# Altium schematic sheet NB3000_Complex.SchDoc
size A4
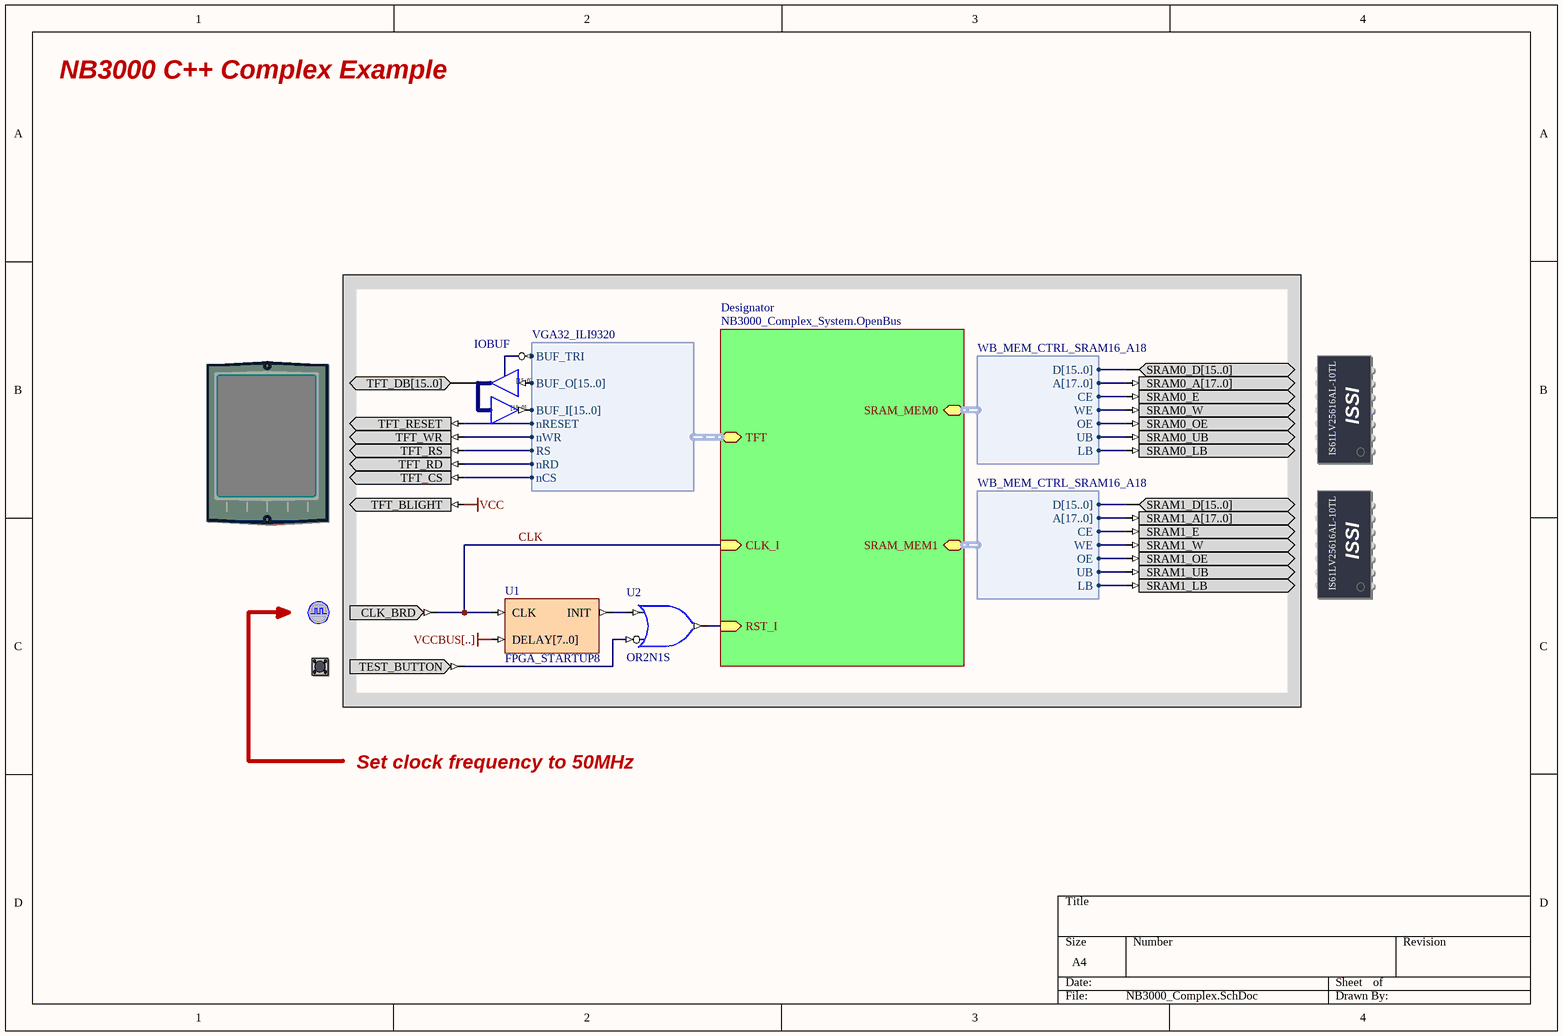
[diagram p0: NB3000_Complex.SchDoc]

## Parts
(Parts that share a designator on the sheet are numbered #1, #2 ... from top to bottom, then left to right.)
?#1  SRAM0  (value not drawn)
?#2  TFT_LCD  (value not drawn)
?#3  SRAM1  (value not drawn)
?#4  CLOCK_BOARD  (value not drawn)
?#5  TEST_BUTTON  (value not drawn)
IOBUF  IOBUF16B  (value not drawn)
U1  FPGA_STARTUP8
U2  OR2N1S

## Sub-sheets
Designator = NB3000_Complex_System.OpenBus: RST_I (in), CLK_I (in), SRAM_MEM0 (harness WB_MEM_CTRL_SRAM16_A18), SRAM_MEM1 (harness WB_MEM_CTRL_SRAM16_A18), TFT (harness VGA32_ILI9320)

## Harnesses
VGA32_ILI9320: BUF_TRI, BUF_O[15..0], BUF_I[15..0], nRESET, nWR, RS, nRD, nCS
WB_MEM_CTRL_SRAM16_A18: D[15..0], A[17..0], CE, WE, OE, UB, LB

## Nets
VCC: ?#2.TFT_BLIGHT
VCCBUS[..]: U1.DELAY[7..0]
CLK: ?#4.CLK_BRD U1.CLK ; sheet Designator/CLK_I
Net?#1_SRAM0_A[17..0]: ?#1.SRAM0_A[17..0] ; sheet Designator/SRAM_MEM0.A[17..0]
Net?#1_SRAM0_D[15..0]: ?#1.SRAM0_D[15..0] ; sheet Designator/SRAM_MEM0.D[15..0]
Net?#1_SRAM0_E: ?#1.SRAM0_E ; sheet Designator/SRAM_MEM0.CE
Net?#1_SRAM0_LB: ?#1.SRAM0_LB ; sheet Designator/SRAM_MEM0.LB
Net?#1_SRAM0_OE: ?#1.SRAM0_OE ; sheet Designator/SRAM_MEM0.OE
Net?#1_SRAM0_UB: ?#1.SRAM0_UB ; sheet Designator/SRAM_MEM0.UB
Net?#1_SRAM0_W: ?#1.SRAM0_W ; sheet Designator/SRAM_MEM0.WE
Net?#2_TFT_CS: ?#2.TFT_CS ; sheet Designator/TFT.nCS
Net?#2_TFT_DB[15..0]: ?#2.TFT_DB[15..0] IOBUF.IO[15..0]
Net?#2_TFT_RD: ?#2.TFT_RD ; sheet Designator/TFT.nRD
Net?#2_TFT_RESET: ?#2.TFT_RESET ; sheet Designator/TFT.nRESET
Net?#2_TFT_RS: ?#2.TFT_RS ; sheet Designator/TFT.RS
Net?#2_TFT_WR: ?#2.TFT_WR ; sheet Designator/TFT.nWR
Net?#3_SRAM1_A[17..0]: ?#3.SRAM1_A[17..0] ; sheet Designator/SRAM_MEM1.A[17..0]
Net?#3_SRAM1_D[15..0]: ?#3.SRAM1_D[15..0] ; sheet Designator/SRAM_MEM1.D[15..0]
Net?#3_SRAM1_E: ?#3.SRAM1_E ; sheet Designator/SRAM_MEM1.CE
Net?#3_SRAM1_LB: ?#3.SRAM1_LB ; sheet Designator/SRAM_MEM1.LB
Net?#3_SRAM1_OE: ?#3.SRAM1_OE ; sheet Designator/SRAM_MEM1.OE
Net?#3_SRAM1_UB: ?#3.SRAM1_UB ; sheet Designator/SRAM_MEM1.UB
Net?#3_SRAM1_W: ?#3.SRAM1_W ; sheet Designator/SRAM_MEM1.WE
Net?#5_TEST_BUTTON: ?#5.TEST_BUTTON U2.I0
NetIOBUF_I[15..0]: IOBUF.I[15..0] ; sheet Designator/TFT.BUF_O[15..0]
NetIOBUF_O[15..0]: IOBUF.O[15..0] ; sheet Designator/TFT.BUF_I[15..0]
NetIOBUF_T: IOBUF.T ; sheet Designator/TFT.BUF_TRI
NetU1_INIT: U1.INIT U2.I1
NetU2_O: U2.O ; sheet Designator/RST_I

## Notes on the sheet
- NB3000 C++ Complex Example
- Set clock frequency to 50MHz
- (in symbol IOBUF16B) [15..0]
- (in symbol SRAM0) ISSI; IS61LV25616AL-10TL
- (in symbol SRAM1) ISSI; IS61LV25616AL-10TL

## Library data of the parts
?#1 = SRAM0: Free Static RAM - Daughterboard; PortComponent: True; Published: 14-May-2007; Publisher: Altium Limited; HelpURL: https://wiki.altium.com/display/ADOH/NanoBoard+3000+-+Independent+SRAM
?#2 = TFT_LCD: TFT LCD Panel; PortComponent: True; Published: 22-Jan-2007; Publisher: Altium Limited; HelpURL: https://wiki.altium.com/display/ADOH/NanoBoard+3000+-+TFT+LCD+Panel+%28with+Touch+Screen%29
?#3 = SRAM1: Free Static RAM - Daughterboard; PortComponent: True; Published: 14-May-2007; Publisher: Altium Limited; HelpURL: https://wiki.altium.com/display/ADOH/NanoBoard+3000+-+Independent+SRAM
?#4 = CLOCK_BOARD: Global System Clock Supply; PortComponent: True; Published: 19-Nov-2003; Publisher: Altium Limited; HelpURL: TR0143 Technical Reference Manual for Altium's Desktop NanoBoard NB2DSK01.pdf#page=41; UseInDSF: True
?#5 = TEST_BUTTON: Test / Reset Button; PortComponent: True; Published: 19-Nov-2003; Publisher: Altium Limited; HelpURL: TR0143 Technical Reference Manual for Altium's Desktop NanoBoard NB2DSK01.pdf#page=53
IOBUF = IOBUF16B: 16-Bit Input/Output Buffer, Bus Version; SubClass: IOBUF; Enable: Low; Control: Common Control T; PortSize: 16; ArchiveName: GENERIC; VHDLIB_SIM: GENERIC_LIB; Published: 29-Jan-2004; Publisher: Altium Limited; LastRevisionNo: 1.00.00; HelpURL: CR0118 FPGA Generic Library Guide.pdf#page=293; ComponentLink1URL: CR0125 FPGA Buffer Resource Usage.pdf#page=91; ComponentLink1Description: Core &Resource Usage; FunctionalClass: Buffer; PortStyle: Bus Version
U1 = FPGA_STARTUP8: FPGA Startup With 8 Bit Delay; Published: 9-Dec-2004; Publisher: Altium Limited; HelpURL: CR0119 FPGA_STARTUPx Powerup Delay Unit.pdf; LastRevisionNo: 1.00.00; ComponentLink1Description: Core &Resource Usage; ComponentLink1URL: CR0139 FPGA Peripheral Resource Usage.pdf#page=11
U2 = OR2N1S: 2-Input OR Gate with Active Low A Input, Single Pin Version; XilinxEquivalent: OR2B1; FunctionalClass: Logic Primitive; PortSize: 2; ArchiveName: GENERIC; VHDLIB_SIM: GENERIC_LIB; Published: 29-Jan-2004; Publisher: Altium Limited; LastRevisionNo: 1.00.00; HelpURL: CR0118 FPGA Generic Library Guide.pdf#page=410; ComponentLink1URL: CR0136 FPGA Logic Primitive Resource Usage.pdf#page=187; ComponentLink1Description: Core &Resource Usage; SubClass: OR; PortStyle: Single Pin Version